# EAGLE board e1-tracer (EAGLE 7.7.0)
REVISION: v1
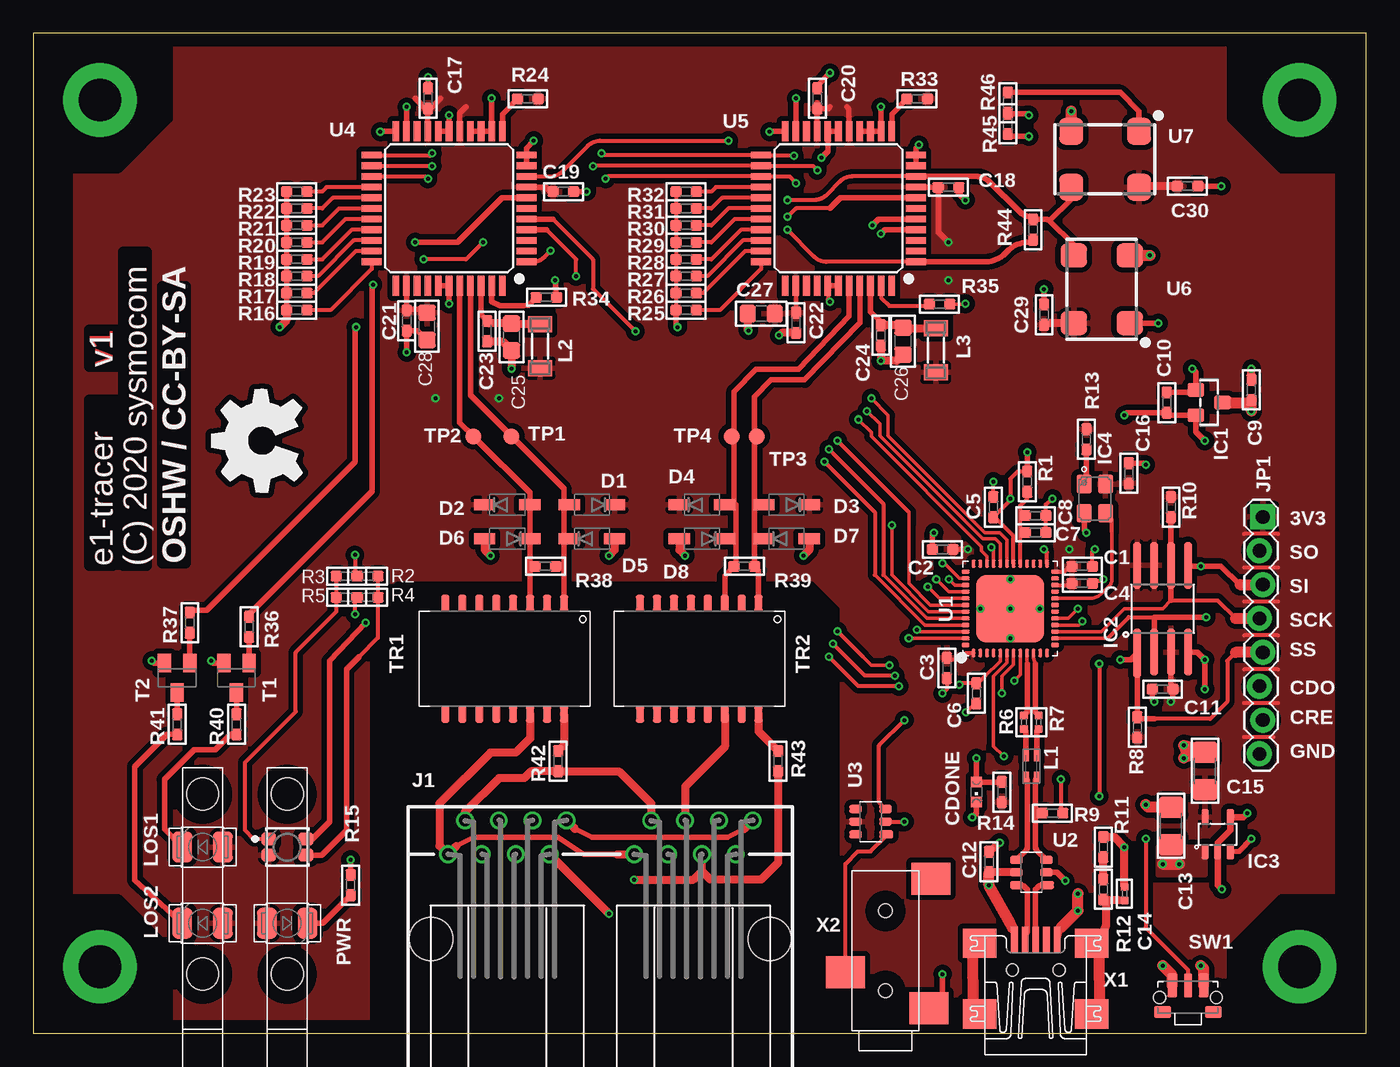
[diagram p2: board, top side]
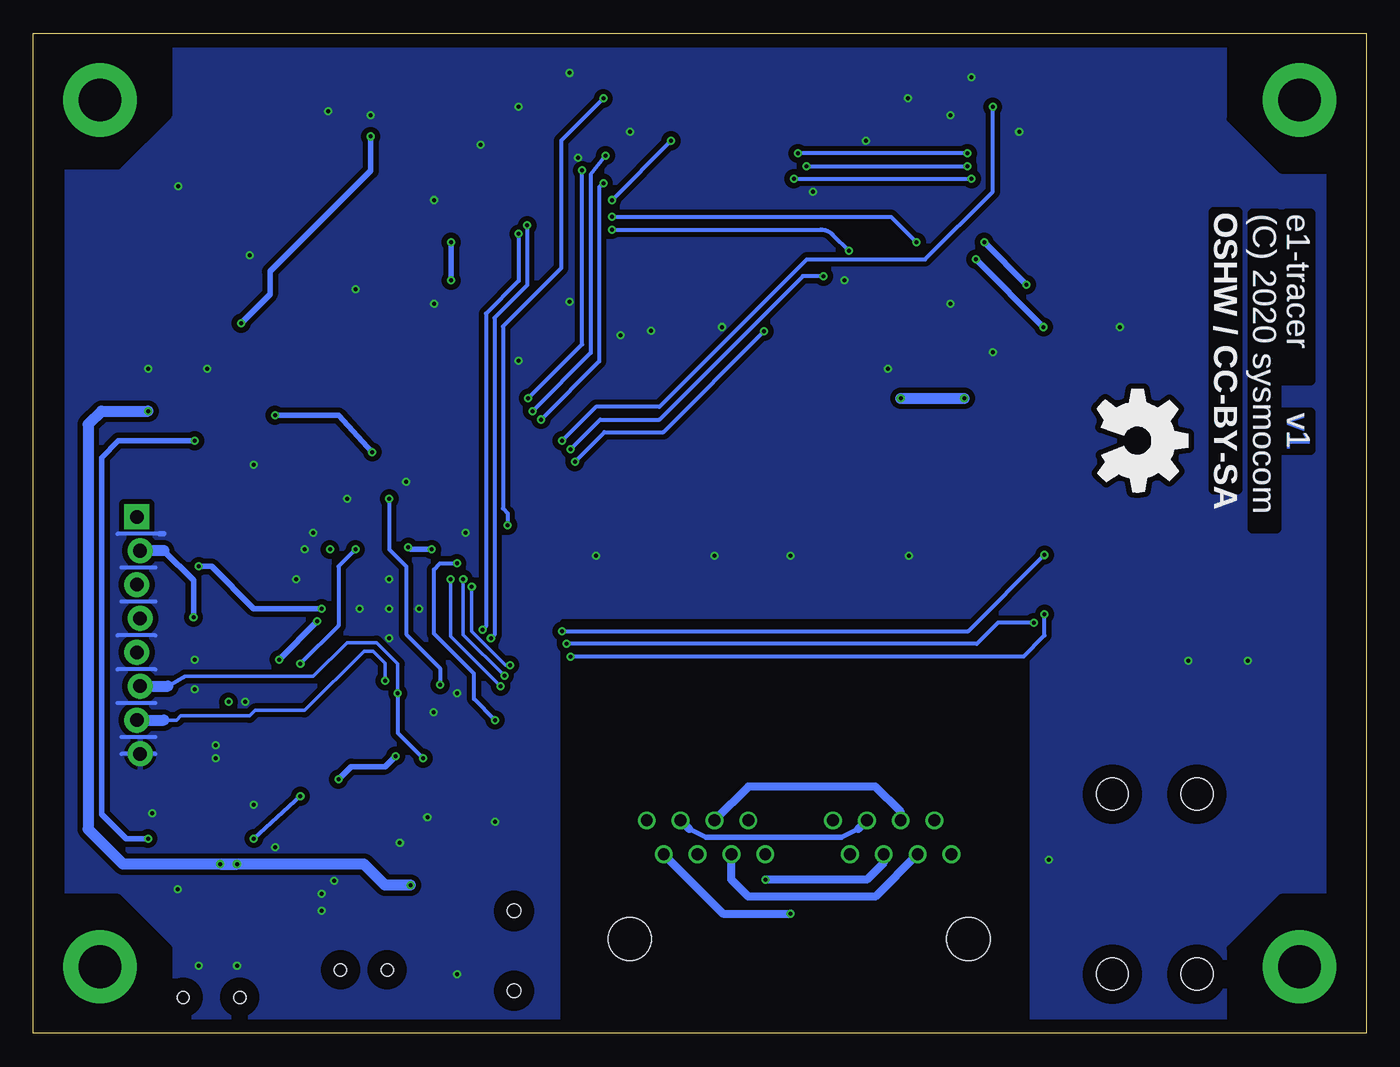
[diagram p3: board, bottom side, seen from below]

Size 100 x 75 mm. Coordinates in mm from the lower left corner, seen from the top.
Outline: 0,0 100,0 100,75 0,75 0,0
Copper layers (1*16): Top 0.035mm / dielectric 1.5mm / Bottom 0.035mm
Design rules "sysmocom-def *": minimum track width 4mil, minimum drill 0.3mm, track to track 4mil, track to pad 6mil, pad to pad 6mil, via to via 6mil, smd to smd 0mil, copper to edge 40mil, drill to drill 8mil, minimum pad ring 6mil, minimum via ring 6mil, stop-mask expansion 4mil, vias tented up to drill 0mil, thermal gap 10mil
Net classes: 1 supply: width 0.4 mm, clearance 0.3 mm to class 0, clearance 0.4 mm; 2 usb: width 0.6 mm, drill 0.2 mm, clearance 0.2 mm to class 0, clearance 0.2 mm to class 1, clearance 0.2 mm; 3 gnd-poly: width 0.4 mm, drill 0.2 mm, clearance 0.3 mm to class 0, clearance 0.4 mm to class 1, clearance 0.2 mm to class 2, clearance 0.2 mm
tRestrict: area 0,64.8 to 10.2,74.9; area 0,0 to 10.2,10.2; area 89.9,0 to 100,10.2; area 89.9,64.8 to 100,74.9
bRestrict: area 89.9,65.1 to 100,75.2; area 0,64.8 to 10.2,74.9; area 0,0 to 10.2,10.2; area 89.9,0 to 100,10.2

## Footprints (pad centres in the part's own frame; a part is rotated, then mirrored left to right if it is on the bottom)
_0603 = smd 0.9 x 0.8: 1 -0.762,0; 2 0.762,0
1206 = smd 1.6 x 1.8: 1 -1.4,0; 2 1.4,0
_0402 = smd 0.6 x 0.6: 1 -0.508,0; 2 0.508,0
_0805 = smd 1.2 x 1.3: 1 -1.016,0; 2 1.016,0
CHIPLED_0603 = smd 0.8 x 0.8: A 0,-0.75; C 0,0.75
SOD123 = smd 1.6 x 0.8: 1 -1.7,0; 2 1.7,0
SOT23-3 = smd 1 x 1.27: 1 -0.95,-1; 2 0.95,-1; 3 0,1
SO08COMBINED = smd 0.6 x 3.7: 1 -1.905,-3.351 | smd 0.6 x 3.5: 2 -0.635,-3.251; 3 0.635,-3.251; 4 1.905,-3.251; 5 1.905,3.251; 6 0.635,3.251; 7 -0.635,3.251; 8 -1.905,3.251
SOT23-DBV = smd 0.55 x 1.2: 1 -0.95,-1.3; 2 0,-1.3; 3 0.95,-1.3; 4 0.95,1.3; 5 -0.95,1.3
TSX-3225 = smd 1.4 x 1.15: 1 -1.1,-0.8; 2 1.1,-0.8; 3 1.1,0.8; 4 -1.1,0.8
557560-1 = drill 0.889: 1-1 -11.43,6.35; 1-2 -10.16,8.89; 1-3 -8.89,6.35; 1-4 -7.62,8.89; 1-5 -6.35,6.35; 1-6 -5.08,8.89; 1-7 -3.81,6.35; 1-8 -2.54,8.89; 2-1 2.54,6.35; 2-2 3.81,8.89; 2-3 5.08,6.35; 2-4 6.35,8.89; 2-5 7.62,6.35; 2-6 8.89,8.89; 2-7 10.16,6.35; 2-8 11.43,8.89 | hole 3.251: -12.7,0; 12.7,0
1X08_LOCK = drill 1.016 pad 1.88 square: 1 0,0.127 | drill 1.016 pad 1.88: 2 2.54,-0.127; 3 5.08,0.127; 4 7.62,-0.127; 5 10.16,0.127; 6 12.7,-0.127; 7 15.24,0.127; 8 17.78,-0.127
WE-CNSW_0805 = smd 0.4 x 0.9: 1 -0.4,-0.85; 2 -0.4,0.85; 3 0.4,0.85; 4 0.4,-0.85
SM-1206 = smd 1.2 x 1.8: 1 -1.65,0; 2 1.65,0
RGBLED_PLCC4 = smd 1.1 x 1: 1 -1.4,0.6; 2 -1.4,-0.6; 3 1.4,-0.6; 4 1.4,0.6
PLCC2-MIN = smd 1.5 x 2.3: A -1.524,0; K 1.524,0
1270.1001 = hole 2.4: 13.5,0; 0,0
TL3340-ORIG = smd 0.75 x 1.8: 1 -1.18,0.9; 3 1.18,0.9 | smd 0.6 x 1.8: 2 0,0.9 | smd 1.27 x 0.9: P$1 -1.905,-1.111; P$2 1.905,-1.111 | hole 0.9: 2.125,0; -2.125,0
SOT23-BEC = smd 1 x 1.4: B -0.95,-1.1; C 0,1.1; E 0.95,-1.1
TP12R = smd 1.2 x 1.2: TP 0,0
PULSE_BH = smd 1.27 x 0.635: 1 -4.23,4.25; 2 -4.23,2.98; 3 -4.23,1.71; 4 -4.23,0.44; 5 -4.23,-0.83; 6 -4.23,-2.1; 7 -4.23,-3.37; 8 -4.23,-4.64; 9 4.1,-4.64; 10 4.1,-3.37; 11 4.1,-2.1; 12 4.1,-0.83; 13 4.1,0.44; 14 4.1,1.71; 15 4.1,2.98; 16 4.1,4.25
QFN48 = smd 0.6 x 0.3: 1 -3.32,2.75; 2 -3.32,2.25; 3 -3.32,1.75; 4 -3.32,1.25; 5 -3.32,0.75; 6 -3.32,0.25; 7 -3.32,-0.25; 8 -3.32,-0.75; 9 -3.32,-1.25; 10 -3.32,-1.75; 11 -3.32,-2.25; 12 -3.32,-2.75; 25 3.38,-2.75; 26 3.38,-2.25; 27 3.38,-1.75; 28 3.38,-1.25; 29 3.38,-0.75; 30 3.38,-0.25; 31 3.38,0.25; 32 3.38,0.75; 33 3.38,1.25; 34 3.38,1.75; 35 3.38,2.25; 36 3.38,2.75 | smd 0.3 x 0.6: 13 -2.72,-3.35; 14 -2.22,-3.35; 15 -1.72,-3.35; 16 -1.22,-3.35; 17 -0.72,-3.35; 18 -0.22,-3.35; 19 0.28,-3.35; 20 0.78,-3.35; 21 1.28,-3.35; 22 1.78,-3.35; 23 2.28,-3.35; 24 2.78,-3.35; 37 2.78,3.35; 38 2.28,3.35; 39 1.78,3.35; 40 1.28,3.35; 41 0.78,3.35; 42 0.28,3.35; 43 -0.22,3.35; 44 -0.72,3.35; 45 -1.22,3.35; 46 -1.72,3.35; 47 -2.22,3.35; 48 -2.72,3.35 | smd 5.08 x 5.08: EXP 0,0
TSOP-6 = smd 0.6 x 1.05: 1 -0.95,-1.175 | smd 0.6 x 0.95: 2 0,-1.125; 3 0.95,-1.125; 4 0.95,1.125; 5 0,1.125; 6 -0.95,1.125
TQFP44 = smd 1.5 x 0.5: 1 -5.8,4; 2 -5.8,3.2; 3 -5.8,2.4; 4 -5.8,1.6; 5 -5.8,0.8; 6 -5.8,0; 7 -5.8,-0.8; 8 -5.8,-1.6; 9 -5.8,-2.4; 10 -5.8,-3.2; 11 -5.8,-4; 23 5.8,-4; 24 5.8,-3.2; 25 5.8,-2.4; 26 5.8,-1.6; 27 5.8,-0.8; 28 5.8,0; 29 5.8,0.8; 30 5.8,1.6; 31 5.8,2.4; 32 5.8,3.2; 33 5.8,4 | smd 0.5 x 1.5: 12 -4,-5.8; 13 -3.2,-5.8; 14 -2.4,-5.8; 15 -1.6,-5.8; 16 -0.8,-5.8; 17 0,-5.8; 18 0.8,-5.8; 19 1.6,-5.8; 20 2.4,-5.8; 21 3.2,-5.8; 22 4,-5.8; 34 4,5.8; 35 3.2,5.8; 36 2.4,5.8; 37 1.6,5.8; 38 0.8,5.8; 39 0,5.8; 40 -0.8,5.8; 41 -1.6,5.8; 42 -2.4,5.8; 43 -3.2,5.8; 44 -4,5.8
HC73 = smd 1.8 x 2: P$1 0,-4.2; P$2 5.08,-4.2; P$3 5.08,0; P$4 0,0
UX60-MB-5ST = smd 2 x 0.5: 1 2.25,1.6; 2 2.25,0.8; 3 2.25,0; 4 2.25,-0.8; 5 2.25,-1.6 | smd 2.2 x 2.5: M1 -3.3,-4.2; M2 -3.3,4.2; M3 2,4.2; M4 2,-4.2 | hole 0.9: 0,-1.75; 0,1.75
JACK2.5_SJ-2523 = smd 2.4 x 2.94: 1 -4.3,-3.274; 2 5.4,-3.424; 3 -1.6,3 | hole 1: -3,0; 3,0

## Placement (x,y rotation side)
C1  100n  [_0603]  78.69,35.02 180 top
C2  100n  [_0603]  68.22,36.29 0 top
C3  100n  [_0603]  68.53,27.4 90 top
C4  100n  [_0603]  78.69,33.75 180 top
C5  100n  [_0603]  72.03,39.47 270 top
C6  100n  [_0603]  70.75,25.5 90 top
C7  100n  [_0603]  75.2,37.56 180 top
C8  1u  [_0603]  75.2,38.83 180 top
C9  1u  [_0603]  91.39,48.26 90 top
C10  1u  [_0603]  85.04,47.31 90 top
C11  100n  [_0603]  84.72,25.81 180 top
C12  1u  [_0603]  71.71,12.86 90 top
C13  22u  [1206]  85.36,15.56 90 top
C14  10n  [_0402]  81.87,10.48 90 top
C15  22u  [1206]  87.9,19.68 90 top
C16  100n  [_0603]  82.19,42.01 90 top
C17  100n  [_0603]  29.61,70.12 90 top
C18  100n  [_0603]  68.66,63.45 0 top
C19  100n  [_0603]  39.77,63.13 0 top
C20  100n  [_0603]  58.82,70.12 90 top
C21  100n  [_0603]  28.02,53.45 270 top
C22  100n  [_0603]  57.23,53.29 270 top
C23  100n  [_0603]  34.05,52.66 270 top
C24  100n  [_0603]  63.58,52.34 270 top
C25  22u  [_0805]  35.88,52.23 90 top
C26  22u  [_0805]  65.25,51.91 90 top
C27  22u  [_0805]  54.61,53.98 0 top
C28  22u  [_0805]  29.53,53.02 90 top
C29  100n  [_0603]  75.83,53.9 270 top
C30  100n  [_0603]  86.6,63.55 180 top
CDONE  BLUE  [CHIPLED_0603]  70.75,18.1 180 top
D1  MBR0540T1  [SOD123]  41.91,39.64 180 top
D2  MBR0540T1  [SOD123]  35.56,39.64 0 top
D3  MBR0540T1  [SOD123]  56.52,39.64 180 top
D4  MBR0540T1  [SOD123]  50.16,39.64 0 top
D5  MBR0540T1  [SOD123]  41.91,37.1 0 top
D6  MBR0540T1  [SOD123]  35.56,37.1 180 top
D7  MBR0540T1  [SOD123]  56.52,37.1 0 top
D8  MBR0540T1  [SOD123]  50.16,37.1 180 top
IC1  MCP1703T-1202E/CB  [SOT23-3]  88.22,47.31 270 top
IC2  W25Q80DVSNIG  [SO08COMBINED]  84.72,31.84 0 top
IC3  TLV70233DBVR  [SOT23-DBV]  88.85,14.92 0 top
IC4  ASEM1-12.000MHZ-LC-T  [TSX-3225]  79.64,40.1 270 top
J1  PASSTHROUGH  [557560-1]  42.55,7.08 0 top
JP1  [1X08_LOCK]  92.11,38.73 270 top
L1  744231091  [WE-CNSW_0805]  74.88,20 180 top
L2  47nH  [SM-1206]  38.02,51.55 270 top
L3  47nH  [SM-1206]  67.71,51.23 270 top
LED1  [RGBLED_PLCC4]  19.05,13.97 0 top
LOS1  LEDPLCC2-MIN-red  [PLCC2-MIN]  12.7,13.97 180 top
LOS2  LEDPLCC2-MIN-red  [PLCC2-MIN]  12.7,8.26 180 top
M1  MENTOR_12701001  [1270.1001]  12.7,4.45 90 top
M2  MENTOR_12701001  [1270.1001]  19.05,4.45 90 top
PWR  LEDPLCC2-MIN-green  [PLCC2-MIN]  19.05,8.26 0 top
R1  100R  [_0603]  74.56,41.37 90 top
R2  DNP  [_0603]  25.08,34.29 180 top
R3  DNP  [_0603]  23.5,34.29 180 top
R4  DNP  [_0603]  25.08,32.7 180 top
R5  DNP  [_0603]  23.5,32.7 180 top
R6  33  [_0402]  74.32,23.34 270 top
R7  33  [_0402]  75.43,23.34 270 top
R8  10k  [_0603]  82.82,22.95 270 top
R9  1k5  [_0603]  76.47,16.51 180 top
R10  10k  [_0603]  85.36,39.47 90 top
R11  100k  [_0603]  80.28,13.97 270 top
R12  100k  [_0603]  80.28,10.79 270 top
R13  10k  [_0603]  79.01,44.55 90 top
R14  2.2k  [_0603]  72.66,18.1 90 top
R15  330  [_0603]  23.81,11.11 90 top
R16  10k  [_0603]  19.77,54.24 180 top
R17  10k  [_0603]  19.77,55.52 180 top
R18  10k  [_0603]  19.77,56.78 180 top
R19  10k  [_0603]  19.77,58.05 180 top
R20  10k  [_0603]  19.77,59.33 180 top
R21  10k  [_0603]  19.77,60.59 180 top
R22  10k  [_0603]  19.77,61.87 180 top
R23  10k  [_0603]  19.77,63.13 180 top
R24  10k  [_0603]  37.1,70.09 0 top
R25  10k  [_0603]  48.98,54.24 180 top
R26  10k  [_0603]  48.98,55.52 180 top
R27  10k  [_0603]  48.98,56.78 180 top
R28  10k  [_0603]  48.98,58.05 180 top
R29  10k  [_0603]  48.98,59.33 180 top
R30  10k  [_0603]  48.98,60.59 180 top
R31  10k  [_0603]  48.98,61.87 180 top
R32  10k  [_0603]  48.98,63.13 180 top
R33  10k  [_0603]  66.31,70.09 0 top
R34  3k 1%  [_0603]  38.5,55.2 180 top
R35  3k 1%  [_0603]  67.99,54.69 180 top
R36  10k  [_0603]  16.19,30.48 90 top
R37  10k  [_0603]  11.75,30.8 90 top
R38  120  [_0603]  38.42,35.02 0 top
R39  120  [_0603]  53.34,35.02 0 top
R40  330  [_0603]  15.24,23.18 90 top
R41  330  [_0603]  10.79,23.18 90 top
R42  1k  [_0603]  39.37,20.41 90 top
R43  1k  [_0603]  55.88,20.41 90 top
R44  DNP  [_0603]  75.01,60.28 90 top
R45  DNP  [_0603]  73.11,68.22 90 top
R46  DNP  [_0603]  73.11,69.8 90 top
SW1  TACTSW-TL3340  [TL3340-ORIG]  86.63,2.7 0 top
T1  BC847C  [SOT23-BEC]  15.24,26.67 180 top
T2  BC847C  [SOT23-BEC]  10.79,26.67 180 top
TP1  TPTP12R  [TP12R]  35.88,44.77 90 top
TP2  TPTP12R  [TP12R]  33.02,44.77 90 top
TP3  TPTP12R  [TP12R]  54.29,44.77 90 top
TP4  TPTP12R  [TP12R]  52.39,44.77 90 top
TR1  PULSE_T1094NL  [PULSE_BH]  35.56,28.04 270 top
TR2  PULSE_T1094NL  [PULSE_BH]  50.16,28.04 270 top
U1  ICE40UP5K-SG48I  [QFN48]  73.3,31.84 90 top
U2  IP4234CZ6  [TSOP-6]  74.88,12.06 90 top
U3  IP4234CZ6  [TSOP-6]  62.82,15.88 90 top
U4  IDT82V2081  [TQFP44]  31.2,61.87 180 top
U5  IDT82V2081  [TQFP44]  60.41,61.87 180 top
U6  2.048 Mhz  [HC73]  78.06,53.26 90 top
U7  1.544 MHz  [HC73]  82.95,63.45 180 top
U$1  [OSHW_8MM_COPPER]  17.17,44.42 90 top
U$3  [OSHW_8MM_COPPER]  17.17,44.48 270 bottom
X1  MINI-USB-SHIELD-UX60-MB-5ST  [UX60-MB-5ST]  75.2,4.76 90 top
X2  JACK2.5_SJ-2523  [JACK2.5_SJ-2523]  63.93,6.19 90 top

## Tracks (layer width: path | path; a pad name or v marks a point on that pad's centre or on a via)
!CRESET  (via drill 0.3)
  Top 0.254: U1.8 74.05,26.88 v73.61,26.45
  Bottom 0.254: v73.61,26.45 73.61,27.77 74.51,28.67 75.2,28.67 79.64,24.23 83.36,24.23 83.77,23.81 88.94,23.81 89.26,23.5 90.21,23.5
  Bottom 0.813: JP1.7 90.21,23.5
_D_N
  Top 0.4: L1.4 74.48,22.67 R6.2
_D_P
  Top 0.4: L1.1 75.28,22.68 R7.2
BOOT_SW  (via drill 0.3)
  Top 0.305: U1.25 76.05,36.08 v75.83,36.29 | v79.96,27.72 v79.96,17.78 | v83.45,14.61 83.45,7.94 86.63,4.76 SW1.2
  Bottom 0.305: v75.83,36.29 77.11,35.02 77.11,30.57 v79.96,27.72 | v79.96,17.78 v83.45,14.61
CDONE  (via drill 0.3)
  Top 0.254: U1.7 73.55,27.65 72.66,26.77 v72.66,25.5
  Top 0.406: v70.75,20.64 CDONE.A 72.42,18.85 R14.2
  Bottom 0.254: 89.89,26.04 88.62,26.77 79.01,26.77 76.47,29.3 74.25,29.3 72.66,27.72 v72.66,25.5
  Bottom 0.305: v72.66,25.5 72.66,22.54 v70.75,20.64
  Bottom 0.813: JP1.6 89.89,26.04
CLK_12M
  Top 0.254: U1.20 79.26,32.62 arc45 80.16,33 80.73,33.56 arc45 80.92,34.01 80.92,37.63 | IC4.3 80.73,38.72
  Top 0.305: 80.92,37.63 80.92,38.53 IC4.3
GND  (via drill 0.3)
  Top 0.254: R45.2 R46.1
  Top 0.305: C7.1 C8.1 75.96,39.66 v76.47,40.1 | C6.1 70.63,24.73 v69.96,24.07 | C5.1 v72.03,41.37 | R32.2 R31.2 R30.2 R29.2 R28.2 R27.2 R26.2 R25.2 | U5.38 59.6,55.05 v59.77,54.88 | C3.1 68.53,25.81 v68.22,25.5 | C1.1 79.45,36.1 v79.64,36.29 | v80.28,34.07 80.15,33.94 79.64,33.94 C4.1 | R35.1 v69.93,54.72 | U3.2 v65.36,15.88
  Top 0.4: U4.39 v31.2,54.72 | C28.1 28.84,52.69 C21.2
  Top 0.406: R16.2 R17.2 R18.2 R19.2 R20.2 R21.2 R22.2 R23.2 | IC2.4 87.34,28.59 v87.9,28.04 v87.9,25.81 | X1.5 77.12,7.95 | U2.2 76.79,12.06 v77.42,11.43 | C29.1 v75.83,55.8 | U5.10 U5.11 66.2,66.39 v66.44,66.63 | U4.10 U4.11 36.99,66.39 v37.55,66.94 | C16.2 83.15,42.77 arc-45 v83.45,42.64 | IC4.2 78.84,37.73 v79.01,37.56 | C10.2 87.03,48.07 IC1.1 87.22,49.58 v86.95,49.85 | C2.1 67.45,37.43 v67.58,37.56 | U5.15 U5.14 U5.13 63.6,69.46 v63.58,69.48 | U4.15 U4.14 U4.13 34.4,70.09 v34.37,70.12 | v31.2,68.85 U4.17 U4.18 | U5.17 U5.18 59.6,66.14 v59.13,65.67 | U5.39 U5.38 | U4.38 U4.39 | C19.2 v41.51,63.13 | C17.2 v29.61,71.71 | C21.2 v28.02,51.07 | R34.1 39.26,55.39 v39.13,56.47 | C20.2 58.94,71.2 v59.77,72.03 | C18.2 69.42,63.01 v69.93,62.5 | R25.2 48.21,53.1 v48.34,52.98 | C11.2 83.96,24.99 v84.09,24.86 | R15.2 v23.81,13.02 | T2.E 9.06,27.77 v8.89,27.94 | T1.E 13.51,27.77 v13.34,27.94 | CDONE.C 70.75,16.51 v70.44,16.19 | R45.2 74.5,68.98 v74.69,68.85 | X2.1 68.25,1.26 v68.22,4.45 | C30.1 v89.14,63.55 | U4.22 26.07,67.67 v26.04,67.63 | U5.22 55.28,67.67 v55.24,67.63
  Top 0.5: v89.17,10.79 88.85,11.11 IC3.2 88.85,14.29 89.81,15.24 IC3.4 90.79,16.22 v91.08,16.51
  Top 0.6: C23.2 35.2,51.9 C25.1 v35.88,49.85
  Top 0.61: C14.2 v81.87,13.97 81.11,14.73 R11.1 | C12.2 v72.5,14.29 | C22.2 56.15,52.53 v55.96,52.34 | C9.2 v91.39,49.85 | C24.2 v63.58,50.44 64.79,50.44 C26.1 | R16.2 19,53.48 v18.5,52.98 | D7.2 58.22,36.26 v57.78,35.83 | D8.2 48.47,36.26 v48.9,35.83 | D6.2 33.86,36.26 v34.29,35.83 | D5.2 43.61,36.26 v43.18,35.83 | C27.1 53.59,52.77 v53.66,52.7
  Top 0.813: 77.12,7.95 v78.38,9.21 v78.38,10.48 | U7.P$2 v77.87,69.17 | U6.P$2 v83.77,58.34 | SW1.1 85.45,4.36 v84.72,5.08 | SW1.3 87.81,4.85 v87.58,5.08 | C13.2 83.64,16.96 v83.45,17.14 | C15.2 86.5,21.09 v86.31,21.59 87.9,21.27 v86.31,20.64
  Bottom 0.305: 90.84,22.23 93.39,22.23 | 90.84,29.84 93.7,29.84 | 90.84,32.38 93.39,32.38 | 90.84,20.95 93.39,20.95 | 90.84,34.92 93.39,34.92 | 90.84,27.3 93.7,27.3 | 90.84,24.77 93.7,24.77 | 90.53,37.47 93.7,37.47
  Bottom 0.406: 90.21,37.47 90.53,37.47
  other vias: 73.3,31.84 71.07,31.84 75.52,31.84 73.3,34.07 73.3,29.62
  pour Bottom: 3.17,73.98 97.47,73.98 97.47,0.32 3.17,0.32
IO_A0  (via drill 0.3)
  Top 0.254: U1.31 73.05,37.02 72.5,37.56 71.39,37.56 64.14,44.81 64.14,46.35 v62.87,47.62
  Top 0.305: v58.82,64.72 58.48,65.06 U5.24 42.02,65.06 v41.99,65.04 | U4.24 29.9,65.06 v29.93,65.04
  Bottom 0.305: v41.99,65.04 v29.93,65.04 | v62.87,47.62 58.82,51.67 v58.82,64.72
IO_A1  (via drill 0.3)
  Top 0.254: U1.32 72.55,36.72 72.18,37.08 71.23,37.08 63.5,44.81 63.5,45.72 v62.55,46.67
  Top 0.305: 57.04,65.86 U5.23 42.81,65.86 v42.62,65.99 | U4.23 29.73,65.86
  Top 0.406: 57.04,65.86 v57.07,65.83 | 29.73,65.86 v29.93,65.99
  Bottom 0.305: v57.07,65.83 58.18,64.41 58.18,51.04 v62.55,46.67 | v29.93,65.99 v42.62,65.99
IO_A2  (via drill 0.3)
  Top 0.254: 71.55,35.66 U1.34 71.55,35.77 71.12,36.2 71.12,36.51 62.87,44.77 62.87,45.09 v61.91,46.04
  Top 0.305: v57.23,63.77 56.73,64.27 U5.25 43.12,64.27 v42.94,64.09 | U4.25 29.43,64.27 v29.61,64.09
  Bottom 0.305: v57.23,63.77 57.55,63.45 57.55,50.4 v61.91,46.04 | v42.94,64.09 v29.61,64.09
IO_A3  (via drill 0.3)
  Top 0.254: v68.22,35.24 68.37,35.24 69.49,34.12 U1.38
  Top 0.305: U3.3 63.45,17.32 63.45,21.59 v65.36,23.5
  Bottom 0.305: v65.36,23.5 66.94,25.08 66.94,26.99 69.94,29.99 69.94,34.78 69.48,35.24 v68.22,35.24
IO_A4  (via drill 0.3)
  Top 0.254: U1.42 67.3,32.12 65.67,33.75 65.67,38.1 65.67,39.1
  Top 0.305: v60.33,44.45 65.67,39.1
  Top 0.406: U4.21 28,69.46 v28.02,69.48
  Bottom 0.305: v28.02,69.48 28.02,63.13 33.1,58.05 41.96,58.05 53.02,46.99 57.78,46.99 v60.33,44.45
IO_A5  (via drill 0.3)
  Top 0.254: U1.43 67.17,31.62 64.41,34.38 v64.41,38.1
  Top 0.406: U5.21 57.2,68.19 57.23,68.22 v57.23,70.12
  Bottom 0.305: v57.23,70.12 60.41,66.94 60.41,57.39 64.77,53.02 64.77,39.37 64.41,39.01 v64.41,38.1
IO_B0  (via drill 0.3)
  Top 0.254: U1.44 67.03,31.12 63.77,34.38
  Top 0.305: v40.72,56.78 40.72,58.05 38.51,60.27 | v59.69,43.81 63.77,39.73 63.77,34.38
  Top 0.406: U4.4 38.51,60.27
  Bottom 0.305: v59.69,43.81 57.47,46.04 53.02,46.04 42.27,56.78 v40.72,56.78
IO_B1  (via drill 0.3)
  Top 0.254: U1.45 66.89,30.62 63.13,34.38
  Top 0.305: 38.98,61.06 41.99,58.05 41.99,55.83 v45.16,52.66 | v59.37,42.86 63.13,39.1 63.13,34.38
  Top 0.406: U4.5 38.98,61.06
  Bottom 0.305: v59.37,42.86 57.15,45.09 52.74,45.09 v45.16,52.66
IO_B2  (via drill 0.3)
  Top 0.254: U1.46 66.44,30.12 v66.31,30.26
  Top 0.406: U5.4 63.88,60.27 v63.58,59.96
  Bottom 0.305: v63.58,59.96 63.58,56.44 66.04,53.98 66.04,30.53 v66.31,30.26
IO_B3  (via drill 0.3)
  Top 0.254: U1.47 65.99,29.62 v65.67,29.62
  Top 0.406: U5.5 63.41,61.06 v62.95,60.59
  Bottom 0.305: v62.95,60.59 62.95,56.12 65.41,53.66 65.41,29.89 v65.67,29.62
IOB_32A_SPI_SO  (via drill 0.3)
  Top 0.254: U1.14 80.6,29.62
  Top 0.305: 80.6,29.62 82.19,31.21 84.09,31.21
  Top 0.406: IC2.2 84.09,31.21 v87.99,31.21
  Bottom 0.406: v87.99,31.21 87.99,33.97 90.21,36.2
  Bottom 0.813: 90.21,36.2 JP1.2
IOB_33B_SPI_SI  (via drill 0.3)
  Top 0.254: U1.17 77.66,31.12 v78.38,31.84
  Top 0.406: 90.53,33.66 89.1,35.02 v87.58,35.02 86.71,35.02 IC2.5
  Top 0.813: 90.53,33.66 JP1.3
  Bottom 0.406: v87.58,35.02 86.63,35.02 83.45,31.84 v78.38,31.84
IOB_34A_SPI_SCK
  Top 0.254: U1.15 80.15,30.12 81.87,31.84 84.72,31.84 85.36,32.48
  Top 0.305: 85.36,32.48 88.84,32.48 90.21,31.11
  Top 0.406: 85.36,32.48 IC2.6 R10.1
  Top 0.813: 90.21,31.11 JP1.4
IOB_35B_SPI_SS  (via drill 0.3)
  Top 0.254: U1.16 78.42,30.62 v78.69,30.89
  Top 0.305: 90.21,28.57 89.58,27.94 89.58,24.86 88.31,23.59 84.09,23.59
  Top 0.406: v81.55,28.04 82.36,28.04 IC2.1 R8.1 82.95,23.59 84.09,23.59
  Top 0.813: JP1.5 90.21,28.57
  Bottom 0.406: v78.69,30.89 v81.55,28.04
LOS0  (via drill 0.3)
  Top 0.406: U4.7 35.17,62.66 31.83,59.33 v28.66,59.33 | R36.2 16.19,31.43 25.4,40.64 25.4,56.07 v25.48,56.15
  Bottom 0.406: v28.66,59.33 v25.48,56.15
LOS1  (via drill 0.3)
  Top 0.305: 59.77,61.87 57.23,61.87 v56.59,61.23 | v33.73,59.33 32.47,58.05 v29.29,58.05
  Top 0.406: U5.7 60.57,62.66 59.77,61.87 | R37.2 11.94,31.75 13.02,31.75 24.13,42.86 24.13,52.9 v24.21,52.98
  Bottom 0.305: v56.59,61.23 35.64,61.23 v33.73,59.33
  Bottom 0.406: v29.29,58.05 v24.21,52.98
MCLK  (via drill 0.3)
  Top 0.254: 74.9,61.23 74.9,61.15 R44.2
  Top 0.305: U4.9 38.78,64.27 arc45 39.68,64.64 41.62,66.57 arc-45 42.52,66.94 v52.15,66.94 | U5.9 61.43,64.27 arc45 60.53,63.89 59.51,62.87 arc-45 58.61,62.5 v56.59,62.5
  Top 0.406: U5.9 70.81,64.27 arc-45 71.71,63.89 74,61.6 arc45 74.9,61.23 | R44.2 76.02,61.04 arc-45 76.25,60.95 | U6.P$3 78.06,59.13 76.25,60.95 | U7.P$3 77.87,62.56 76.25,60.95
  Bottom 0.305: v56.59,62.5 v52.15,66.94
N$1
  Top 0.305: U5.43 63.6,55.17 64.22,54.56 66.78,54.56 R35.2
N$2
  Top 0.406: U5.12 64.41,68.91 R33.1
N$3
  Top 0.305: C24.1 63.62,53.1
  Top 0.4: 62.8,54.13 63.58,53.35 C24.1 | 65.07,53.1 C26.2 65.3,52.88
  Top 0.406: U5.42 62.8,54.13
  Top 0.61: 65.07,53.1 C24.1 | 65.3,52.88 L3.1
N$4
  Top 0.406: U4.43 34.4,54.85 35.01,54.56 36.78,54.56 37.15,54.61 R34.2
N$5
  Top 0.61: TR2.16 54.41,22.64 R43.2
N$6
  Top 0.305: U5.33 54.6,57.34 51.52,54.24 R25.1
N$7
  Top 0.305: U5.32 53.4,58.66 50.24,55.52 R26.1
N$8
  Top 0.305: U4.33 25.39,57.34 22.3,54.24 R16.1
N$9
  Top 0.305: U4.32 24.18,58.66 21.04,55.52 R17.1
N$10
  Top 0.305: U4.31 24.03,59.47 21.35,56.78 R18.1
N$11
  Top 0.305: R19.1 21.67,58.05 23.88,60.27 U4.30
N$12
  Top 0.305: R20.1 21.67,59.33 23.41,61.06 U4.29
N$13
  Top 0.305: R21.1 21.67,60.59 22.94,61.87 U4.28
N$14
  Top 0.305: U4.27 22.47,62.66 21.67,61.87 R22.1
N$15
  Top 0.305: U5.31 53.24,59.47 50.56,56.78 R27.1
N$16
  Top 0.305: U5.30 53.09,60.27 50.88,58.05 R28.1
N$17
  Top 0.406: U4.12 35.2,68.91 R24.1
N$18
  Top 0.305: U4.26 22,63.47 21.67,63.13 R23.1
N$19
  Top 0.305: U5.29 52.62,61.06 50.88,59.33 R29.1
N$20
  Top 0.305: U5.28 52.15,61.87 50.88,60.59 R30.1
N$21
  Top 0.305: U5.27 51.68,62.66 50.88,61.87 R31.1
N$22
  Top 0.305: U5.26 51.21,63.47 50.88,63.13 R32.1
N$23
  Top 0.406: U4.42 33.59,53.88 C23.1
  Top 0.6: L2.1 35.93,53.2 C25.2 34.23,53.24 C23.1
N$24
  Top 0.61: TR2.14 51.88,21.49 48.9,18.51 J1.2-4
  Bottom 0.61: J1.1-4 34.92,16.61 36.83,18.51 46.35,18.51 J1.2-4
N$25
  Top 0.406: R13.1 79.01,41.37 IC4.1
N$26
  Top 0.406: T1.B R36.1
N$27
  Top 0.406: R40.1 14.8,22.42 13.65,21.27 12.06,21.27 9.84,19.05 9.84,15.3 LOS1.K
N$28
  Top 0.406: T1.C R40.2
N$29
  Top 0.406: PWR.K 21.72,8.26 R15.1
N$30
  Top 0.61: J1.1-2 32.38,16.61 34.92,19.14 36.83,19.14 37.34,19.65 R42.1 43.94,19.65 46.35,17.24 J1.2-2
N$31
  Top 0.406: T2.B R37.1
N$32
  Top 0.406: 31.75,14.06 33.02,14.7 39.37,14.7 41.27,13.43 43.81,13.43
  Top 0.61: TR1.14 37.27,22.12 36.2,21.05 34.29,21.05 30.48,17.24 30.48,14.06 J1.1-1 31.75,14.06 | 43.81,13.43 J1.2-1
N$33
  Top 0.406: 40.64,15.34 41.91,14.7 52.07,14.7 53.34,15.34
  Top 0.61: J1.1-8 40.64,15.34 | 53.34,15.34 J1.2-8
N$34  (via drill 0.3)
  Top 0.61: J1.1-7 v43.18,8.98
  Bottom 0.61: v43.18,8.98 48.26,8.98 J1.2-7
N$35  (via drill 0.3)
  Top 0.406: v74.69,67.26 73.3,67.26 R45.1 | U6.P$1 v84.41,53.26
  Bottom 0.406: v74.69,67.26 74.69,64.69 82.23,57.15 82.23,55.44 v84.41,53.26
N$36
  Top 0.813: X1.M3 70.44,6.2 70.48,1.91 71.56,1.46 X1.M2
N$37
  Top 0.406: LOS2.K 7.62,11.49 7.62,20 10.03,22.42 R41.1
N$38
  Top 0.406: U7.P$1 82.95,69.17 81.55,70.56 R46.2
N$39
  Top 0.406: T2.C R41.2
N$40
  Bottom 0.406: 38.1,15.34 39.37,14.7 49.53,14.7 50.8,15.34
  Bottom 0.61: J1.1-6 38.1,15.34 | 50.8,15.34 J1.2-6
N$41  (via drill 0.3)
  Top 0.61: R43.1 55.88,12.79 54.61,11.53 50.8,11.53 50.16,12.16 | 50.16,12.16 J1.2-5 | v45.09,11.53 49.53,11.53 50.16,12.16
  Bottom 0.61: J1.1-5 36.2,12.79 37.47,11.53 v45.09,11.53
N$42
  Top 0.61: TR1.16 39.81,21.62 R42.2
N$43
  Bottom 0.61: J1.1-3 36.83,10.26 46.35,10.26 47.62,11.53 J1.2-3
N$44
  cutout Bottom: 25.4,-0.86 25.4,30.89 60.33,30.89 60.33,-0.86
  cutout Top: 25.4,31.84 27.3,33.75 58.42,33.75 60.33,31.84 60.33,-0.86 25.4,-0.86
N$45  (via drill 0.3)
  Top 0.254: U1.41 67.97,32.62 v67.1,33.5 | v64.25,27.62 62.87,27.62 62.07,28.42
  Top 0.305: 62.23,28.26 62.07,28.42 v60.33,30.16 | v24.13,35.88 24.13,34.48 R2.2 R3.1
  Bottom 0.254: v67.1,33.5 67.1,30.16 64.56,27.62 v64.25,27.62
  Bottom 0.305: v60.33,30.16 29.84,30.16 v24.13,35.88
N$46
  Top 0.305: LED1.1 16.55,14.57 15.88,15.24 15.88,20.32 19.68,24.13 19.68,28.57 22.73,31.62 R5.2 R3.2
N$47  (via drill 3.2 pad 5.5)
  other vias: 5,5
N$48  (via drill 3.2 pad 5.5)
  other vias: 95,5
N$49  (via drill 3.2 pad 5.5)
  other vias: 95,70
N$52
  Top 0.254: C7.2 74.05,37.56 | C8.2 74.05,38.83
  Top 0.305: U1.29 74.05,37.56 74.05,38.83 74.05,39.58 74.56,40.1 R1.1
N$55
  Top 0.61: R12.1 R11.2
N$61
  Top 0.61: X1.M4 79.96,6.67 80.5,8.16 80.5,9.62 R12.2 81.3,10.03 C14.1
  Top 0.813: X1.M1 80.01,1.59 79.96,6.35 79.4,6.91 X1.M4
N$63  (via drill 0.3)
  Top 0.254: U1.39 69.13,33.62 v68.69,34.07
  Top 0.305: v59.69,28.26 61.91,26.04 v64.94,26.04 | v24.13,31.43 24.13,32.51 R4.2 R5.1
  Bottom 0.254: v68.69,34.07 68.69,29.78 v64.94,26.04
  Bottom 0.305: v59.69,28.26 25.72,28.26 24.13,29.84 v24.13,31.43
N$64  (via drill 0.3)
  Top 0.254: U1.40 68.68,33.12 v67.74,34.07
  Top 0.305: v60.01,29.21 62.39,26.83 v64.66,26.83
  Top 0.406: LED1.4 20.92,14.57 22.23,15.88 22.23,27.94 v24.92,30.8
  Bottom 0.254: v67.74,34.07 67.74,29.91 v64.66,26.83
  Bottom 0.305: v24.92,30.8 27.62,30.8 29.21,29.21 v60.01,29.21
N$65
  Top 0.305: R2.1 R4.1 25.84,29.65 24.45,28.26
  Top 0.406: LED1.3 21.62,13.37 23.5,15.24 23.5,27.3 24.45,28.26
N$200  (via drill 3.2 pad 5.5)
  other vias: 5,70
RRING
  Top 0.406: TR1.3 37.27,35.02 | R38.1 37.27,35.02 | 37.27,35.02 D6.1 D2.2 | 36.99,39.91 D2.2 | U4.40 32,45.79 TP2.TP 33.19,44.77 33.19,44.6 37.26,40.53 D2.2
RRING1
  Top 0.305: R39.1 52.7,35.02 | D4.2 52.7,39.64
  Top 0.406: TR2.3 51.88,34.32 R39.1 | U5.40 61.2,53.77 57.39,49.8 54.21,49.8 52.58,48.13 52.58,44.77 | TP4.TP 52.58,44.77 | 52.58,44.77 52.58,39.77 52.7,39.64 52.7,37.1 | 52.7,35.02 52.7,37.1 | D8.1 52.7,37.1
RTIP
  Top 0.406: TR1.1 39.81,35.02 | R38.2 39.81,35.02 | 39.81,35.02 39.81,36.7 | 39.81,36.7 D5.1 | 39.81,36.7 39.81,39.69 | 39.81,39.69 39.81,40.84 TP1.TP 32.8,47.85 U4.41 | D1.2 39.86,39.64 39.81,39.69
RTIP1
  Top 0.406: U5.41 62.01,53.3 57.87,49.01 55.33,49.01 54.1,47.75 54.1,44.77 | TR2.1 54.41,34.71 R39.2 54.1,37.1 | TP3.TP 54.1,44.77 | 54.1,44.77 54.1,39.64 | 54.1,39.64 54.1,37.1 | D7.1 54.1,37.1 | D3.2 54.1,39.64
TCLK  (via drill 0.3)
  Top 0.305: U5.1 59.48,57.87 arc-46 58.57,58.25 v56.59,60.28 | U4.1 37.46,57.87 arc45 38.36,58.24 v38.81,58.69
  Top 0.406: U5.1 71.06,57.87 arc45 72.79,58.37 73.05,58.64 arc-45 74.58,59.33 74.82,59.33 R44.1
  Bottom 0.305: v56.59,60.28 40.93,60.28 arc45 40.03,59.91 v38.81,58.69
UART_TX0
  Top 0.305: X2.3 60.91,4.61 60.91,12.7 61.87,13.65 62.82,13.65 63.99,14.83 U3.1
USB0_D_N
  Top 0.4: U2.6 74,11.12 arc-45 74.45,10.93 74.58,10.79 74.58,7.62 arc45 74.4,7.18 X1.2
USB0_D_P
  Top 0.4: U2.1 75.77,11.12 arc45 75.32,10.93 75.18,10.79 75.18,6.42 arc45 X1.3
USB1_D_N
  Top 0.4: U2.4 74.49,13.75 arc45 74.58,13.97 74.58,18.91 arc45 L1.3
USB1_D_P
  Top 0.4: U2.3 75.27,13.75 arc-45 75.18,13.97 75.18,16.51 | 75.18,16.51 75.18,18.91 arc-45 L1.2 | R9.2 75.18,16.51
USB_D_N
  Top 0.254: U1.9 74.55,27.75 74.58,27.72
  Top 0.4: 74.58,27.72 74.58,24.1 R6.1
USB_D_P
  Top 0.254: U1.10 75.05,28.17 75.18,27.72
  Top 0.4: 75.18,27.72 75.18,24.1 R7.1
USB_PU  (via drill 0.3)
  Top 0.254: U1.6 73.05,27.79 72.03,26.77 72.03,21.53 v72.82,20.8
  Top 0.305: v77.11,19.05 77.11,16.64 R9.1
  Bottom 0.4: v77.11,19.05 76.15,20 73.61,20 v72.82,20.8
VBUS  (via drill 0.3)
  Top 0.305: C12.1 71.71,12.06
  Top 0.406: X1.1 73.6,7 73.45,7.94
  Top 0.61: U2.5 71.71,12.06 | 91.2,47.31 C9.1
  Top 0.813: 73.45,7.94 73.3,8.26 v71.71,11.11 71.71,12.06 | IC1.3 91.2,47.31 | v91.39,46.67 C9.1 | v84.72,12.7 v86,12.7
  Bottom 0.813: v71.71,11.11 73.61,11.11 75.2,12.7 v84.72,12.7 | v84.72,12.7 93.28,12.7 95.89,15.31 95.89,45.67 94.89,46.67 v91.39,46.67 | v86,12.7 v84.72,12.7
  pour Top (no thermals): 84.41,11.91 87.9,11.91 87.9,13.97 84.41,13.97
VCC_1V2  (via drill 0.3)
  Top 0.254: U1.5 72.55,27.92 71.39,26.77
  Top 0.305: 71.39,26.77 70.88,26.26 C6.2 69.61,26.26 v69.48,26.13 | U1.30 73.55,37.31 72.15,38.7 C5.2 73.3,39.97 v73.3,40.1 73.3,41.59 73.83,42.13 R1.2
  Top 0.406: v87.9,44.45 87.22,45.13 IC1.2 85.23,46.36 C10.1 82.06,46.55 v81.87,46.35 | v74.56,43.59 R1.2 | v91.39,14.61 90.47,13.65 IC3.3
  Bottom 0.305: v73.3,40.1 73.3,36.29 72.03,35.02 72.03,29.94 69.48,27.4 v69.48,26.13
  Bottom 0.406: v87.9,44.45 93.61,44.45 94.89,43.18 94.89,16.45 93.04,14.61 v91.39,14.61 | v81.87,46.35 77.11,46.35 v74.56,43.59
VCC_3V3  (via drill 0.3)
  Top 0.254: v70.12,36.29 69.48,36.29 | U1.33 arc-90 72.03,35.24 72.03,36.2 arc-60 v71.87,36.45 72.05,36.27 U1.33
  Top 0.305: U1.22 77.81,33.62 C4.2 | U5.35 57.2,54.27 57.23,54.24 | U1.24 77.34,34.62 77.74,35.02 | U1.1 69.97,28.52 69.48,28.04 68.66,28.04 C3.2 | 67.72,63.47 67.89,63.47 C18.1 | 58.8,69.79 58.8,69.37 C20.1 | 29.59,69.18 29.59,69.35 C17.1 | 93.39,37.47 90.84,37.47 | 93.39,34.92 90.84,34.92 | 93.39,32.38 90.84,32.38 | 93.39,29.84 90.84,29.84 | 93.39,27.3 90.84,27.3 | 93.39,24.77 90.84,24.77 | 93.07,22.23 90.84,22.23
  Top 0.4: C28.2 29.27,54.29 27.94,54.29
  Top 0.406: C2.2 v70.12,36.29 | U4.8 38.48,63.47 38.81,63.13 | 29.63,69.14 29.61,69.17 30.56,70.12 | U4.35 28,54.27 28.02,54.24 | U4.19 29.59,69.18 28.66,70.12 | U5.19 58.8,69.79 | U5.8 67.72,63.47 | IC2.3 85.36,25.94 C11.1 85.49,24.99 v85.36,24.86 | U4.16 32,69.02 32.47,69.48 | U5.16 61.2,69.32 61.04,69.48 | C20.1 59.64,69.36 59.77,69.48 | C18.1 67.9,60.09 v68.66,59.33
  Top 0.61: U6.P$4 76.15,53.26 | C30.2 83.23,63.55 83.19,63.5
  Bottom 0.406: v68.66,59.33 v68.66,56.47 | v70.12,36.29 71.71,36.29 v71.87,36.45
  Bottom 0.813: v34.92,47.62 v30.16,47.62
  other vias: 77.74,36.29
  pour Top (rank 3): 3.17,73.98 97.47,74.93 97.47,0.64 3.17,0

## Text on the board
Top: e1-tracer | (C) 2020 sysmocom | OSHW / CC-BY-SA
Bottom: OSHW / CC-BY-SA | e1-tracer | (C) 2020 sysmocom
tNames: 3V3 | SO | e1-tracer | (C) 2020 sysmocom | OSHW / CC-BY-SA | SI | SCK | SS | CDO | CRE | GND
bNames: OSHW / CC-BY-SA | e1-tracer | (C) 2020 sysmocom